# Altium schematic sheet Thermal.SchDoc: Thermal Management
size A4; DrawnBy: Samyar Sadat Akhavi; Revision: 1.0; SheetNumber: 8; SheetTotal: 13
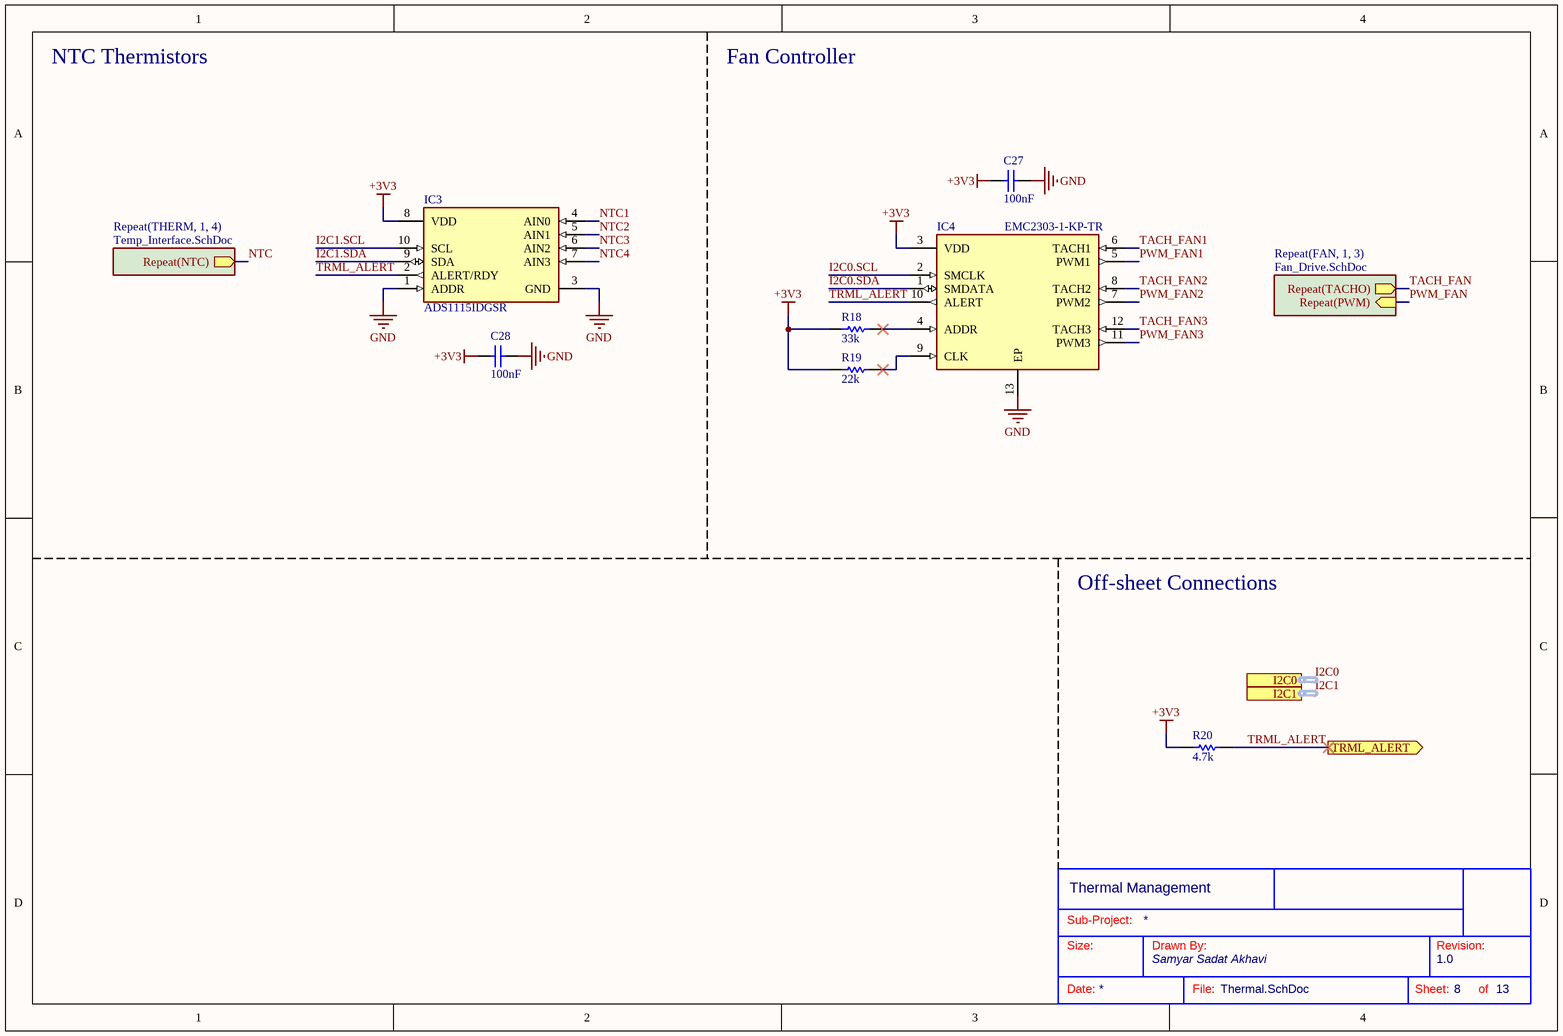
[diagram p0: Thermal.SchDoc]

## Parts
?  (no value)  (graphical)
C27  100nF  [CAP_SMD_603]
C28  100nF  [CAP_SMD_603]
IC3  ADS1115IDGSR  [SOP50P490X110-10N]
IC4  EMC2303-1-KP-TR  [QFN80P400X400X90-13N-D]
R18  33k  [RES_0603]
R19  22k  [RES_0603]
R20  4.7k  [RES_0603]

## Sub-sheets
Repeat(FAN, 1, 3) = Fan_Drive.SchDoc: Repeat(TACHO) (out), Repeat(PWM) (in)
Repeat(THERM, 1, 4) = Temp_Interface.SchDoc: Repeat(NTC) (out)

## Ports
I2C0 (harness I2C, see Sensors_IO_Board[2B], Aux_Power_Bus[4C], Microcontroller[5C], Sensors_IO[3C]), I2C1 (harness I2C, see Sensors_IO_Board[2B], Microcontroller[6C], Sensors_IO[3C]), TRML_ALERT (out, see Sensors_IO_Board[2B], Microcontroller[3C])

## Nets
+3V3: C27.2 C28.2 IC3.8(VDD) IC4.3(VDD) R18.2 R19.2 R20.1
GND: C27.1 C28.1 IC3.1(ADDR) IC3.3(GND) IC4.13(EP)
I2C0.SCL: IC4.2(SMCLK)
I2C0.SDA: IC4.1(SMDATA)
I2C1.SCL: IC3.10(SCL)
I2C1.SDA: IC3.9(SDA)
NTC: sheet Repeat(THERM, 1, 4)/Repeat(NTC)
NTC1: IC3.4(AIN0)
NTC2: IC3.5(AIN1)
NTC3: IC3.6(AIN2)
NTC4: IC3.7(AIN3)
PWM_FAN: sheet Repeat(FAN, 1, 3)/Repeat(PWM)
PWM_FAN1: IC4.5(PWM1)
PWM_FAN2: IC4.7(PWM2)
PWM_FAN3: IC4.11(PWM3)
TACH_FAN: sheet Repeat(FAN, 1, 3)/Repeat(TACHO)
TACH_FAN1: IC4.6(TACH1)
TACH_FAN2: IC4.8(TACH2)
TACH_FAN3: IC4.12(TACH3)
TRML_ALERT: IC3.2(ALERT/RDY) IC4.10(ALERT) R20.2 ; port TRML_ALERT
NetIC4_4: IC4.4(ADDR) R18.1
NetIC4_9: IC4.9(CLK) R19.1

## Buses and harness runs
harness I2C0 = port I2C0
harness I2C1 = port I2C1

## Notes on the sheet
- NTC Thermistors
- Fan Controller
- Off-sheet Connections
- Sub-Project:
- Size:
- Drawn By:
- Revision:
- Date:
- File:
- Sheet:
- of

## Library data of the parts
? = Standard Title Block
C27 C28 = Non-polar Capacitor: Generic Ceramic Capacitor; Voltage: 6.3V; Value: 100nF
IC3 = ADS1115IDGSR: Integrated Circuit; Manufacturer_Name: Texas Instruments; Datasheet Link: http://www.ti.com/lit/gpn/ADS1115; Height: 1.1mm; Manufacturer_Part_Number: ADS1115IDGSR; Mouser Part Number: 595-ADS1115IDGSR; Mouser Price/Stock: https://www.mouser.co.uk/ProductDetail/Texas-Instruments/ADS1115IDGSR?qs=IK5e5L0zOXjKCJoVMhYO%2FQ%3D%3D; Arrow Part Number: ADS1115IDGSR; Arrow Price/Stock: https://www.arrow.com/en/products/ads1115idgsr/texas-instruments?utm_currency=USD&region=nac
IC4 = EMC2303-1-KP-TR: Integrated Circuit; Manufacturer_Name: Microchip; Datasheet Link: https://componentsearchengine.com/Datasheets/1/EMC2303-1-KP-TR.pdf; Height: 0.9mm; Manufacturer_Part_Number: EMC2303-1-KP-TR; Mouser Part Number: 886-EMC2303-1-KP-TR; Mouser Price/Stock: https://www.mouser.co.uk/ProductDetail/Microchip-Technology/EMC2303-1-KP-TR?qs=pA5MXup5wxGoL5M5tUOQYw%3D%3D; Arrow Part Number: EMC2303-1-KP-TR; Arrow Price/Stock: https://www.arrow.com/en/products/emc2303-1-kp-tr/microchip-technology?utm_currency=USD&region=nac
R18-R20 = Resistor: Power: 1/8W
  R18: Value: 33k
  R19: Value: 22k
  R20: Value: 4.7k